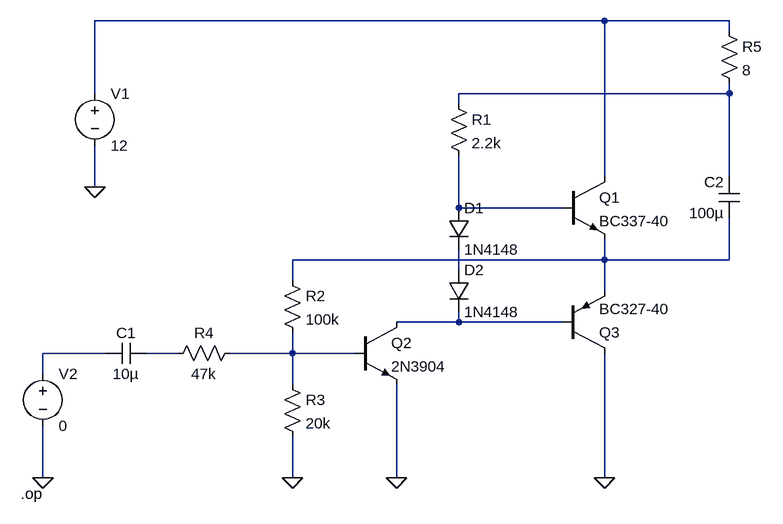
[diagram p0: schematic onetransistor.eu.asc]
onetransistor.eu.asc, the LTspice schematic file:
Version 4
SHEET 1 880 680
WIRE 304 -176 -480 -176
WIRE 496 -176 304 -176
WIRE 496 -160 496 -176
WIRE -480 -64 -480 -176
WIRE 496 -64 496 -80
WIRE 496 -64 80 -64
WIRE 80 -48 80 -64
WIRE 304 64 304 -176
WIRE 496 64 496 -64
WIRE -480 80 -480 16
WIRE 80 112 80 32
WIRE 240 112 80 112
WIRE 304 192 304 160
WIRE 304 192 -176 192
WIRE 496 192 496 128
WIRE 496 192 304 192
WIRE 80 208 80 176
WIRE -176 224 -176 192
WIRE 304 240 304 192
WIRE 80 288 80 272
WIRE 80 288 -16 288
WIRE 240 288 80 288
WIRE -464 336 -560 336
WIRE -352 336 -400 336
WIRE -176 336 -176 304
WIRE -176 336 -272 336
WIRE -80 336 -176 336
WIRE -560 368 -560 336
WIRE -176 384 -176 336
WIRE -560 528 -560 448
WIRE -176 528 -176 464
WIRE -16 528 -16 384
WIRE 304 528 304 336
FLAG -480 80 0
FLAG -560 528 0
FLAG -176 528 0
FLAG -16 528 0
FLAG 304 528 0
SYMBOL npn 240 64 R0
SYMATTR InstName Q1
SYMATTR Value BC337-40
SYMBOL npn -80 288 R0
SYMATTR InstName Q2
SYMATTR Value 2N3904
SYMBOL pnp 240 336 M180
SYMATTR InstName Q3
SYMATTR Value BC327-40
SYMBOL diode 64 112 R0
SYMATTR InstName D1
SYMATTR Value 1N4148
SYMBOL diode 64 208 R0
SYMATTR InstName D2
SYMATTR Value 1N4148
SYMBOL res 64 -64 R0
SYMATTR InstName R1
SYMATTR Value 2.2k
SYMBOL res -192 208 R0
SYMATTR InstName R2
SYMATTR Value 100k
SYMBOL res -192 368 R0
SYMATTR InstName R3
SYMATTR Value 20k
SYMBOL res -256 320 R90
WINDOW 0 0 56 VBottom 2
WINDOW 3 32 56 VTop 2
SYMATTR InstName R4
SYMATTR Value 47k
SYMBOL voltage -480 -80 R0
SYMATTR InstName V1
SYMATTR Value 12
SYMBOL voltage -560 352 R0
SYMATTR InstName V2
SYMATTR Value 0
SYMBOL cap -400 320 R90
WINDOW 0 0 32 VBottom 2
WINDOW 3 32 32 VTop 2
SYMATTR InstName C1
SYMATTR Value 10µ
SYMBOL cap 512 128 R180
WINDOW 0 24 56 Left 2
WINDOW 3 24 8 Left 2
SYMATTR InstName C2
SYMATTR Value 100µ
SYMBOL res 480 -176 R0
SYMATTR InstName R5
SYMATTR Value 8
TEXT -594 552 Left 2 !.op

The netlist it stands for:
* onetransistor.eu.asc
Q1 N001 N003 N004 0 BC337-40
Q2 N006 N009 0 0 2N3904
Q3 0 N006 N004 0 BC327-40
D1 N003 N005 1N4148
D2 N005 N006 1N4148
R1 N002 N003 2.2k
R2 N004 N009 100k
R3 N009 0 20k
R4 N009 N008 47k
V1 N001 0 12
V2 N007 0 0
C1 N008 N007 10µ
C2 N004 N002 100µ
R5 N001 N002 8
.model D D
.lib standard.dio
.model NPN NPN
.model PNP PNP
.lib standard.bjt
.op
.backanno
.end